# Altium schematic sheet esquematico.SchDoc
size A4; SheetNumber: 1; SheetTotal: 2
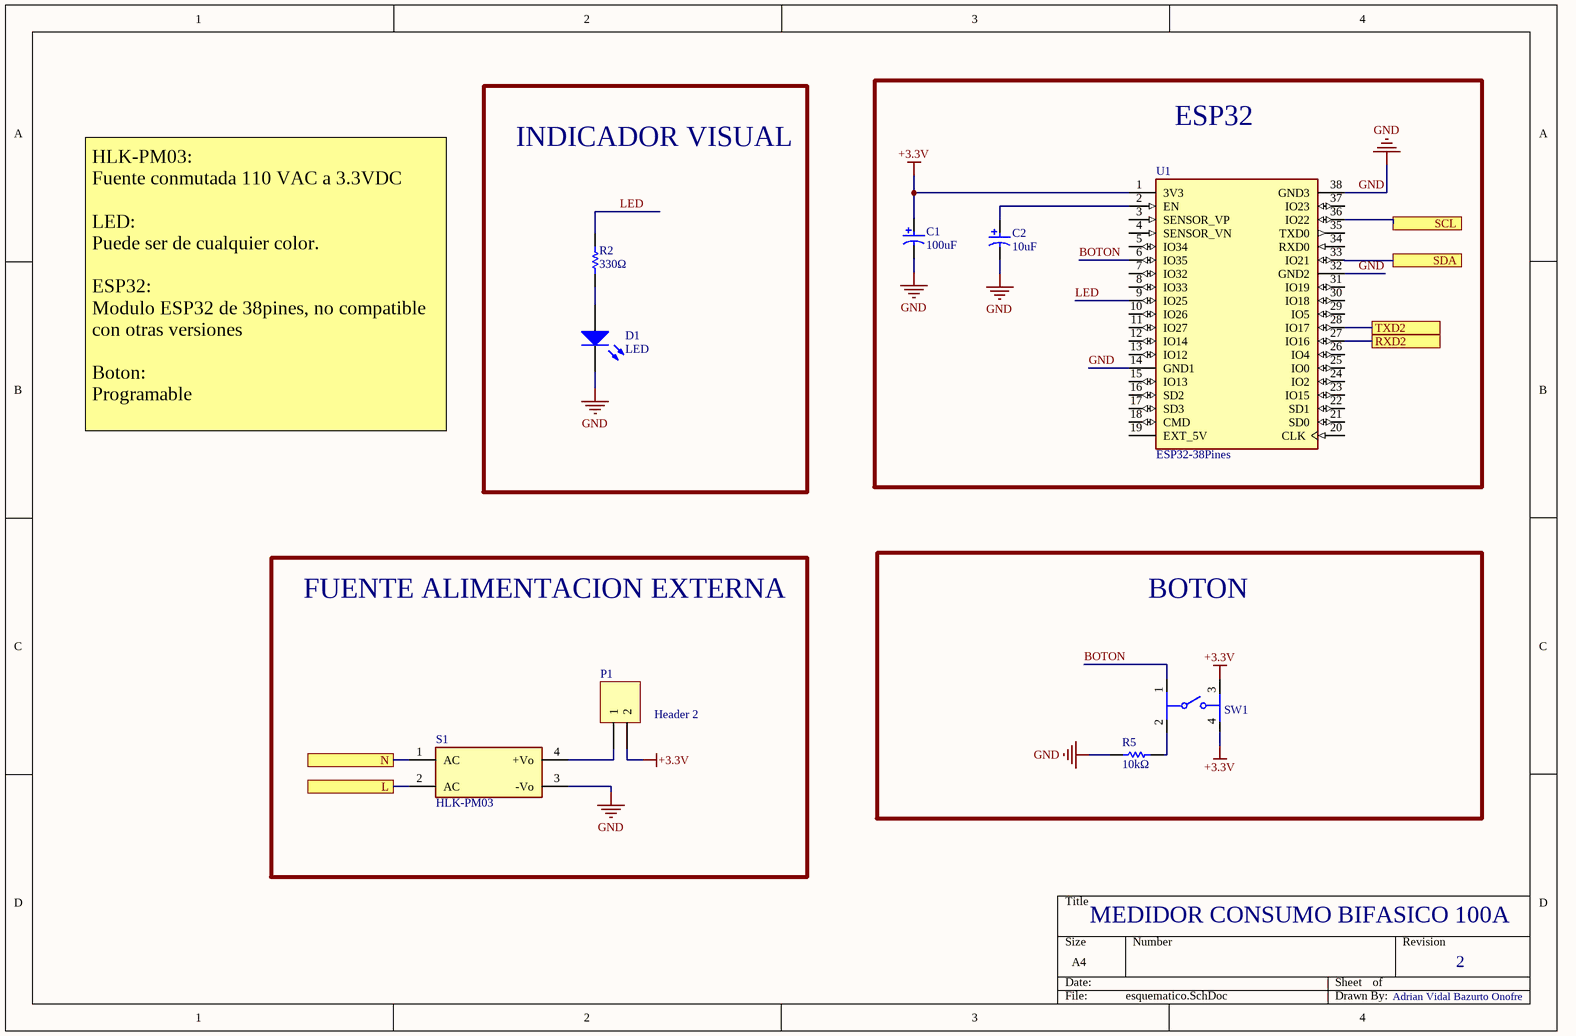
[diagram p0: esquematico.SchDoc]

## Parts
C1  100uF  [FP-CAPACITOR]
C2  10uF  [FP-CAPACITOR]
D1  LED  [FP-LED]
P1  Header 2  [HDR1X2]
R2  330Ω  [FP-RESISTENCIA]
R5  10kΩ  [FP-RESISTENCIA]
S1  HLK-PM03  [FP-HLK-PW12]
SW1  Button  [FP-BUTTON]  (value not drawn)
U1  ESP32-38Pines  [ESP32-38pin]

## Blocks framed on the sheet
INDICADOR VISUAL: D1 R2
ESP32: C1 C2 U1
FUENTE ALIMENTACION EXTERNA: P1 S1
BOTON: R5 SW1

## Ports
L, N, RXD2, SCL, SDA, TXD2

## Nets
+3.3V: C1.1 P1.2 SW1.3 SW1.4 U1.1(3V3)
GND: C1.2 C2.2 D1.2(K) R5.1 S1.3(-Vo) U1.14(GND1) U1.32(GND2) U1.38(GND3)
BOTON: SW1.1 U1.6(IO35)
L: S1.2(AC) ; port L
LED: R2.2 U1.9(IO25)
N: S1.1(AC) ; port N
RXD2: U1.27(IO16) ; port RXD2
SCL: U1.36(IO22) ; port SCL
SDA: U1.33(IO21) ; port SDA
TXD2: U1.28(IO17) ; port TXD2
NetC2_1: C2.1 U1.2(EN)
NetD1_1: D1.1(A) R2.1
NetP1_1: P1.1 S1.4(+Vo)
NetR5_2: R5.2 SW1.2

Not connected (* = marked no-connect by the designer): U1 3(SENSOR_VP) 4(SENSOR_VN) 5(IO34) 7(IO32) 8(IO33) 10(IO26) 11(IO27) 12(IO14) 13(IO12) 15(IO13) 16(SD2) 17(SD3) 18(CMD) 19(EXT_5V) 20(CLK) 21(SD0) 22(SD1) 23(IO15) 24(IO2) 25(IO0) 26(IO4) 29(IO5) 30(IO18) 31(IO19) 34(RXD0) 35(TXD0) 37(IO23)

## Notes on the sheet
- HLK-PM03:
  Fuente conmutada 110 VAC a 3.3VDC
  LED:
  Puede ser de cualquier color.
  ESP32:
  Modulo ESP32 de 38pines, no compatible con otras versiones
  Boton:
  Programable
- MEDIDOR CONSUMO BIFASICO 100A
- 2
- Adrian Vidal Bazurto Onofre

## Library data of the parts
C1 C2 = Electrolytic capacitor
P1 = Header 2: Header, 2-Pin; LatestRevisionDate: 17-Jul-2002; LatestRevisionNote: Re-released for DXP Platform.; Publisher: Altium Limited
R2 R5 = Resistencia
S1 = HLK-PM03: 100-240V a 3.3V
SW1 = Button: Button PCB